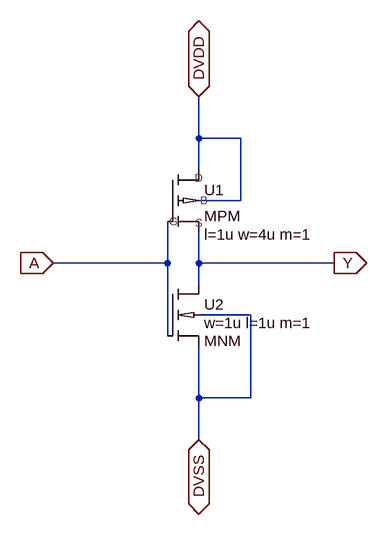
[diagram p0: schematic INV.asc]
INV.asc, the LTspice schematic file:
Version 4
SHEET 1 880 680
WIRE 208 -80 208 -144
WIRE 272 -80 208 -80
WIRE 208 -32 208 -80
WIRE 272 16 272 -80
WIRE 272 16 208 16
WIRE 160 112 160 48
WIRE 160 112 -16 112
WIRE 208 112 208 64
WIRE 416 112 208 112
WIRE 208 144 208 112
WIRE 288 192 208 192
WIRE 160 224 160 112
WIRE 208 320 208 240
WIRE 288 320 288 192
WIRE 288 320 208 320
WIRE 208 384 208 320
FLAG -16 112 A
IOPIN -16 112 In
FLAG 208 -144 DVDD
IOPIN 208 -144 BiDir
FLAG 208 384 DVSS
IOPIN 208 384 BiDir
FLAG 416 112 Y
IOPIN 416 112 Out
SYMBOL MPN 192 16 R0
WINDOW 39 24 52 Left 2
SYMATTR SpiceLine l=1u w=4u m=1
SYMATTR InstName U1
SYMATTR Value MPM
SYMBOL NMD4 160 144 R0
WINDOW 3 56 60 Left 2
WINDOW 38 56 88 Left 2
SYMATTR Value w=1u l=1u m=1
SYMATTR SpiceModel MNM
SYMATTR InstName U2

The netlist it stands for:
* INV.asc
XU1 DVDD A Y DVDD MPM l=1u w=4u m=1  ; pins D G S B
XU2 Y A DVSS DVSS MNM w=1u l=1u m=1  ; pins D G S B
.backanno
.end